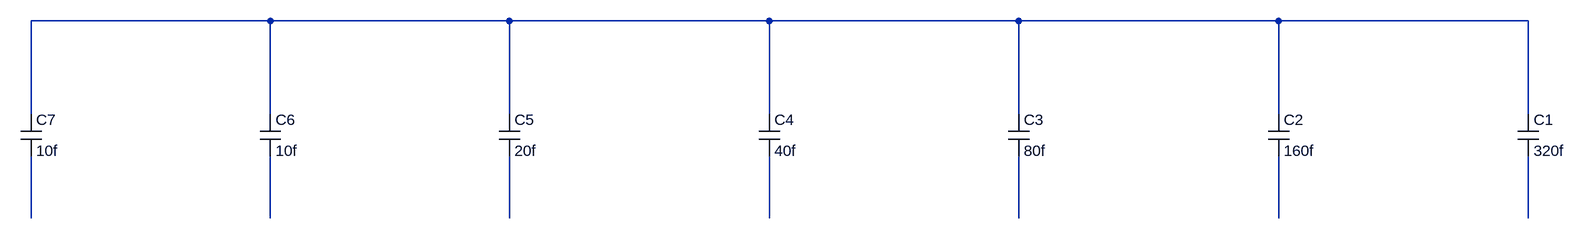
[diagram p0: schematic Draft5.asc]
Draft5.asc, the LTspice schematic file:
Version 4
SHEET 1 2020 680
WIRE -16 160 -384 160
WIRE 352 160 -16 160
WIRE 752 160 352 160
WIRE 1136 160 752 160
WIRE 1536 160 1136 160
WIRE 1920 160 1536 160
WIRE -384 304 -384 160
WIRE -16 304 -16 160
WIRE 352 304 352 160
WIRE 752 304 752 160
WIRE 1136 304 1136 160
WIRE 1536 304 1536 160
WIRE 1920 304 1920 160
WIRE -384 464 -384 368
WIRE -16 464 -16 368
WIRE 352 464 352 368
WIRE 752 464 752 368
WIRE 1136 464 1136 368
WIRE 1536 464 1536 368
WIRE 1920 464 1920 368
SYMBOL cap 1904 304 R0
SYMATTR InstName C1
SYMATTR Value 320f
SYMBOL cap 1520 304 R0
SYMATTR InstName C2
SYMATTR Value 160f
SYMBOL cap 1120 304 R0
SYMATTR InstName C3
SYMATTR Value 80f
SYMBOL cap 736 304 R0
SYMATTR InstName C4
SYMATTR Value 40f
SYMBOL cap 336 304 R0
SYMATTR InstName C5
SYMATTR Value 20f
SYMBOL cap -32 304 R0
SYMATTR InstName C6
SYMATTR Value 10f
SYMBOL cap -400 304 R0
SYMATTR InstName C7
SYMATTR Value 10f

The netlist it stands for:
* Draft5.asc
C1 N001 N008 320f
C2 N001 N007 160f
C3 N001 N006 80f
C4 N001 N005 40f
C5 N001 N004 20f
C6 N001 N003 10f
C7 N001 N002 10f
.backanno
.end